# EAGLE design XO-Tester (EAGLE 6.2)
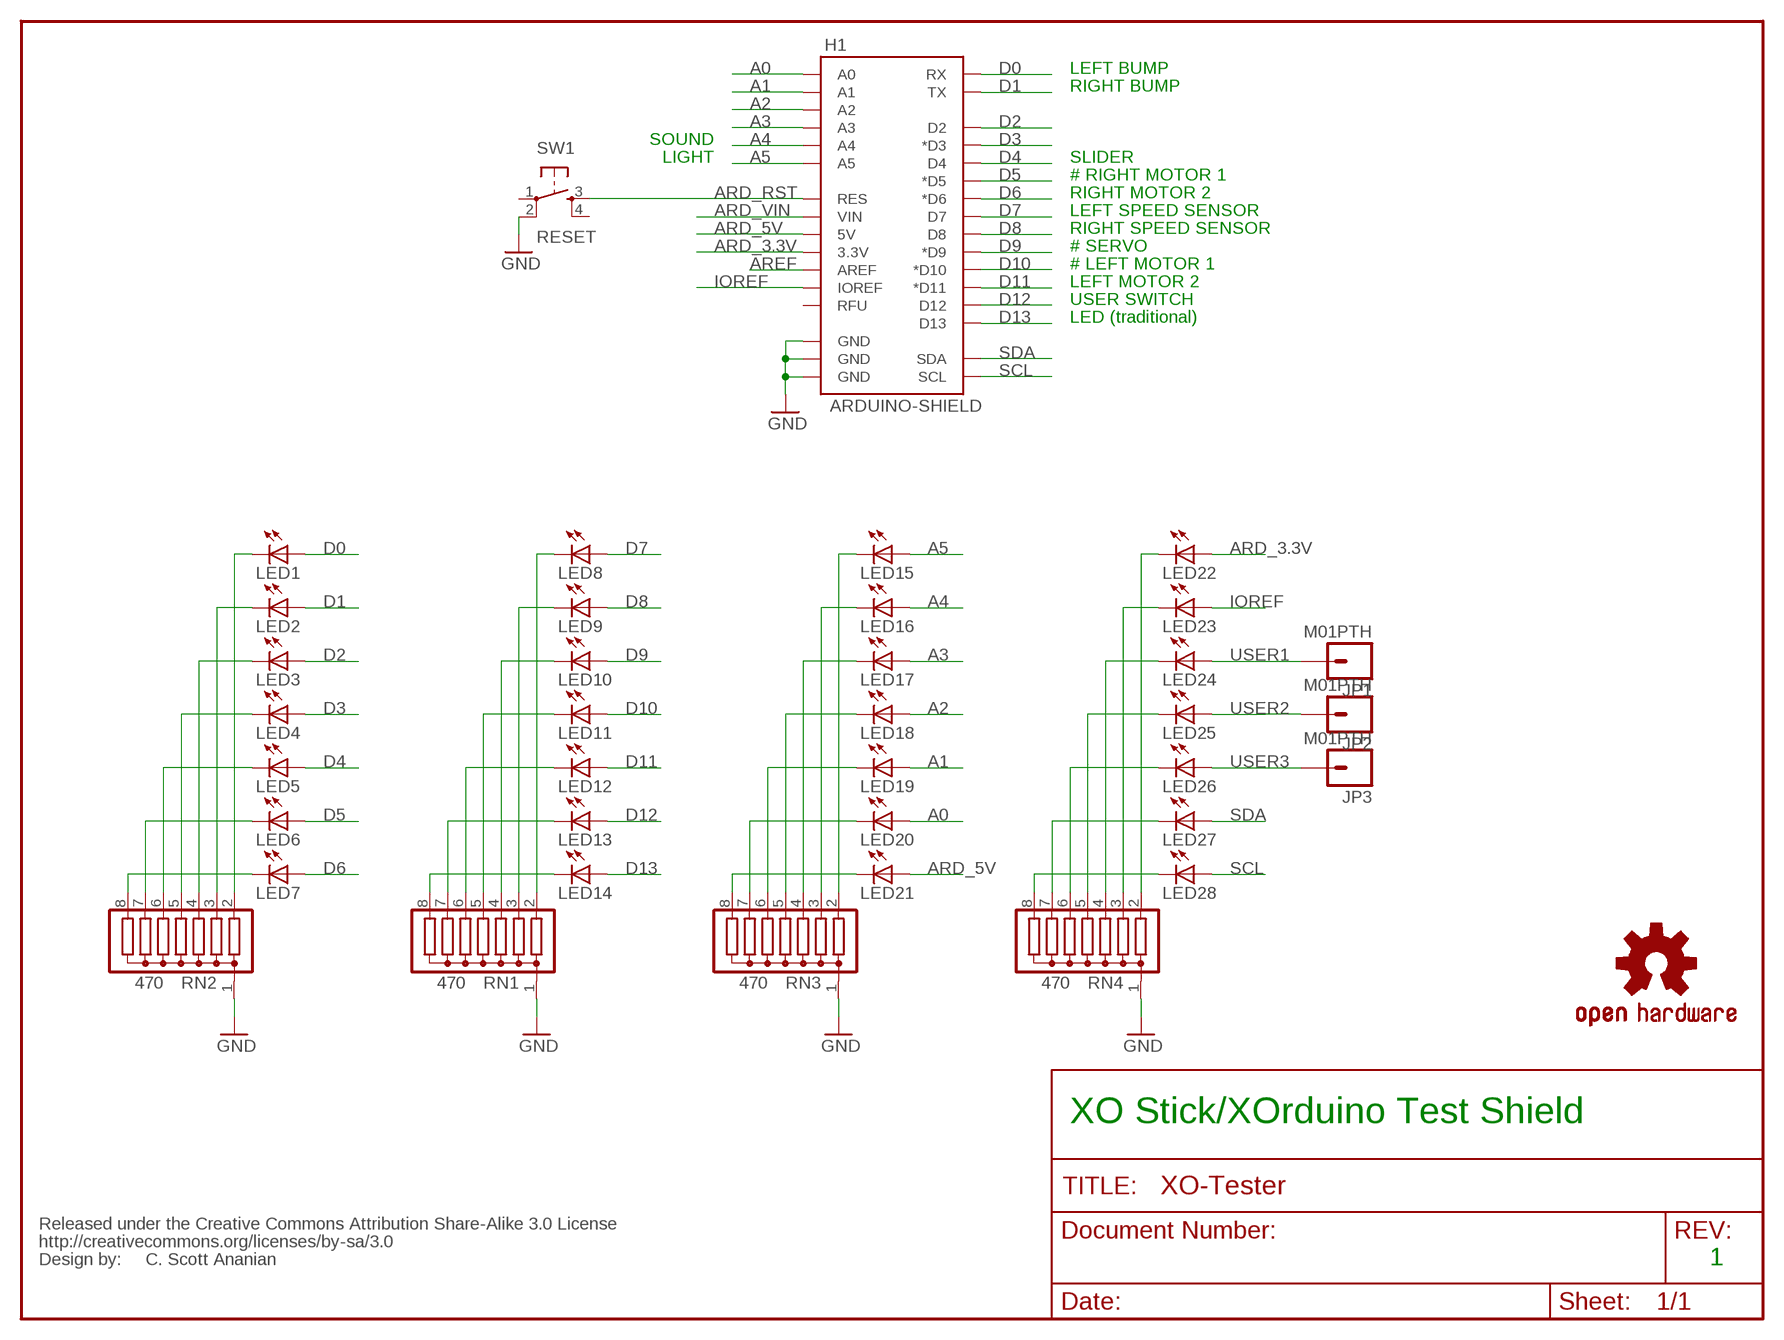
[diagram p0: schematic, sheet 1]

## Parts
H1  ARDUINO-SHIELD  [ARDUINO-SHIELD-VIAS-HOLES]
JP1  M01PTH  [1X01]
JP2  M01PTH  [1X01]
JP3  M01PTH  [1X01]
LED1  LED3MM-KIT  [LED3MM-KIT]
LED2  LED3MM-KIT  [LED3MM-KIT]
LED3  LED3MM-KIT  [LED3MM-KIT]
LED4  LED3MM-KIT  [LED3MM-KIT]
LED5  LED3MM-KIT  [LED3MM-KIT]
LED6  LED3MM-KIT  [LED3MM-KIT]
LED7  LED3MM-KIT  [LED3MM-KIT]
LED8  LED3MM-KIT  [LED3MM-KIT]
LED9  LED3MM-KIT  [LED3MM-KIT]
LED10  LED3MM-KIT  [LED3MM-KIT]
LED11  LED3MM-KIT  [LED3MM-KIT]
LED12  LED3MM-KIT  [LED3MM-KIT]
LED13  LED3MM-KIT  [LED3MM-KIT]
LED14  LED3MM-KIT  [LED3MM-KIT]
LED15  LED3MM-KIT  [LED3MM-KIT]
LED16  LED3MM-KIT  [LED3MM-KIT]
LED17  LED3MM-KIT  [LED3MM-KIT]
LED18  LED3MM-KIT  [LED3MM-KIT]
LED19  LED3MM-KIT  [LED3MM-KIT]
LED20  LED3MM-KIT  [LED3MM-KIT]
LED21  LED3MM-KIT  [LED3MM-KIT]
LED22  LED3MM-KIT  [LED3MM-KIT]
LED23  LED3MM-KIT  [LED3MM-KIT]
LED24  LED3MM-KIT  [LED3MM-KIT]
LED25  LED3MM-KIT  [LED3MM-KIT]
LED26  LED3MM-KIT  [LED3MM-KIT]
LED27  LED3MM-KIT  [LED3MM-KIT]
LED28  LED3MM-KIT  [LED3MM-KIT]
RN1  470  G07R  [SIL8]
RN2  470  G07R  [SIL8]
RN3  470  G07R  [SIL8]
RN4  470  G07R  [SIL8]
SW1  RESET  TAC_SWITCHPTH  [TACTILE-PTH]
U$1  OSHW-LOGOM  [OSHW-LOGO-M]
U$4  CREATIVE_COMMONS  [CREATIVE_COMMONS]

## Nets
A0: H1.A0 LED20.A
A1: H1.A1 LED19.A
A2: H1.A2 LED18.A
A3: H1.A3 LED17.A
A4: H1.A4 LED16.A
A5: H1.A5 LED15.A
ARD_3.3V [vcc]: H1.3.3V LED22.A
ARD_5V [vcc]: H1.5V LED21.A
ARD_RST: H1.RES SW1.3
ARD_VIN [vcc]: H1.VIN
AREF: H1.AREF
D0: H1.RX LED1.A
D1: H1.TX LED2.A
D2: H1.D2 LED3.A
D3: H1.D3(*D3) LED4.A
D4: H1.D4 LED5.A
D5: H1.D5(*D5) LED6.A
D6: H1.D6(*D6) LED7.A
D7: H1.D7 LED8.A
D8: H1.D8 LED9.A
D9: H1.D9(*D9) LED10.A
D10: H1.D10(*D10) LED11.A
D11: H1.D11(*D11) LED12.A
D12: H1.D12 LED13.A
D13: H1.D13 LED14.A
GND [gnd]: H1.GND@0(GND) H1.GND@1(GND) H1.GND@2(GND) RN1.1 RN2.1 RN3.1 RN4.1 SW1.2
IOREF: H1.IOREF LED23.A
N$1: LED8.K(C) RN1.2
N$2: LED9.K(C) RN1.3
N$3: LED1.K(C) RN2.2
N$4: LED2.K(C) RN2.3
N$5: LED3.K(C) RN2.4
N$6: LED4.K(C) RN2.5
N$7: LED5.K(C) RN2.6
N$8: LED6.K(C) RN2.7
N$9: LED7.K(C) RN2.8
N$10: LED10.K(C) RN1.4
N$11: LED11.K(C) RN1.5
N$12: LED12.K(C) RN1.6
N$13: LED13.K(C) RN1.7
N$14: LED14.K(C) RN1.8
N$15: LED15.K(C) RN3.2
N$16: LED16.K(C) RN3.3
N$17: LED17.K(C) RN3.4
N$18: LED18.K(C) RN3.5
N$19: LED19.K(C) RN3.6
N$20: LED20.K(C) RN3.7
N$21: LED21.K(C) RN3.8
N$22: LED22.K(C) RN4.2
N$23: LED23.K(C) RN4.3
N$24: LED24.K(C) RN4.4
N$25: LED25.K(C) RN4.5
N$26: LED26.K(C) RN4.6
N$27: LED27.K(C) RN4.7
N$28: LED28.K(C) RN4.8
SCL: H1.SCL LED28.A
SDA: H1.SDA LED27.A
USER1: JP1.1 LED24.A
USER2: JP2.1 LED25.A
USER3: JP3.1 LED26.A
Unconnected: H1.RFU SW1.1 SW1.4

## Notes on the sheet
- LEFT BUMP
- RIGHT BUMP
- SOUND
- LIGHT | SLIDER
- # RIGHT MOTOR 1
- RIGHT MOTOR 2
- LEFT SPEED SENSOR
- RIGHT SPEED SENSOR
- # SERVO
- # LEFT MOTOR 1
- LEFT MOTOR 2
- USER SWITCH
- LED (traditional)
- XO Stick/XOrduino Test Shield
- C. Scott Ananian | 1

## Library data of the parts
H1 = xorduino:ARDUINO-SHIELD: Arduino 1.0 Shield Footprint.
JP1-JP3 = SparkFun-Connectors:M01: Header 1 Standard 1-pin 0.1" header. Use with straight break away headers (SKU : PRT-00116), right angle break away headers (PRT-00553), swiss pins (PRT-00743), machine pins (PRT-00117), and female headers (PRT-00115).
LED1-LED28 = xorduino:LED
RN1-RN4 = resistor-sil:G07R: SIL RESISTOR; OC_FARNELL: unknown; OC_NEWARK: unknown
SW1 = SparkFun:TAC_SWITCH: Momentary Switch Button commonly used for reset or general input. Spark Fun Electronics SKU : COM-00097
U$1 = SparkFun:OSHW-LOGO: Open Source Hardware Logo This logo indicates the piece of hardware it is found on incorporates a OSHW license and/or adheres to the definition of open source hardware found here: http://freedomdefined.org/OSHW
U$4 = SparkFun:CREATIVE_COMMONS

## Net classes
0 default: width 0.254 mm, drill 0.508 mm, clearance 0.254 mm
1 vcc: width 0.508 mm, drill 0.508 mm, clearance 0.254 mm
2 gnd: width 0.508 mm, drill 0.508 mm, clearance 0.254 mm

## Board
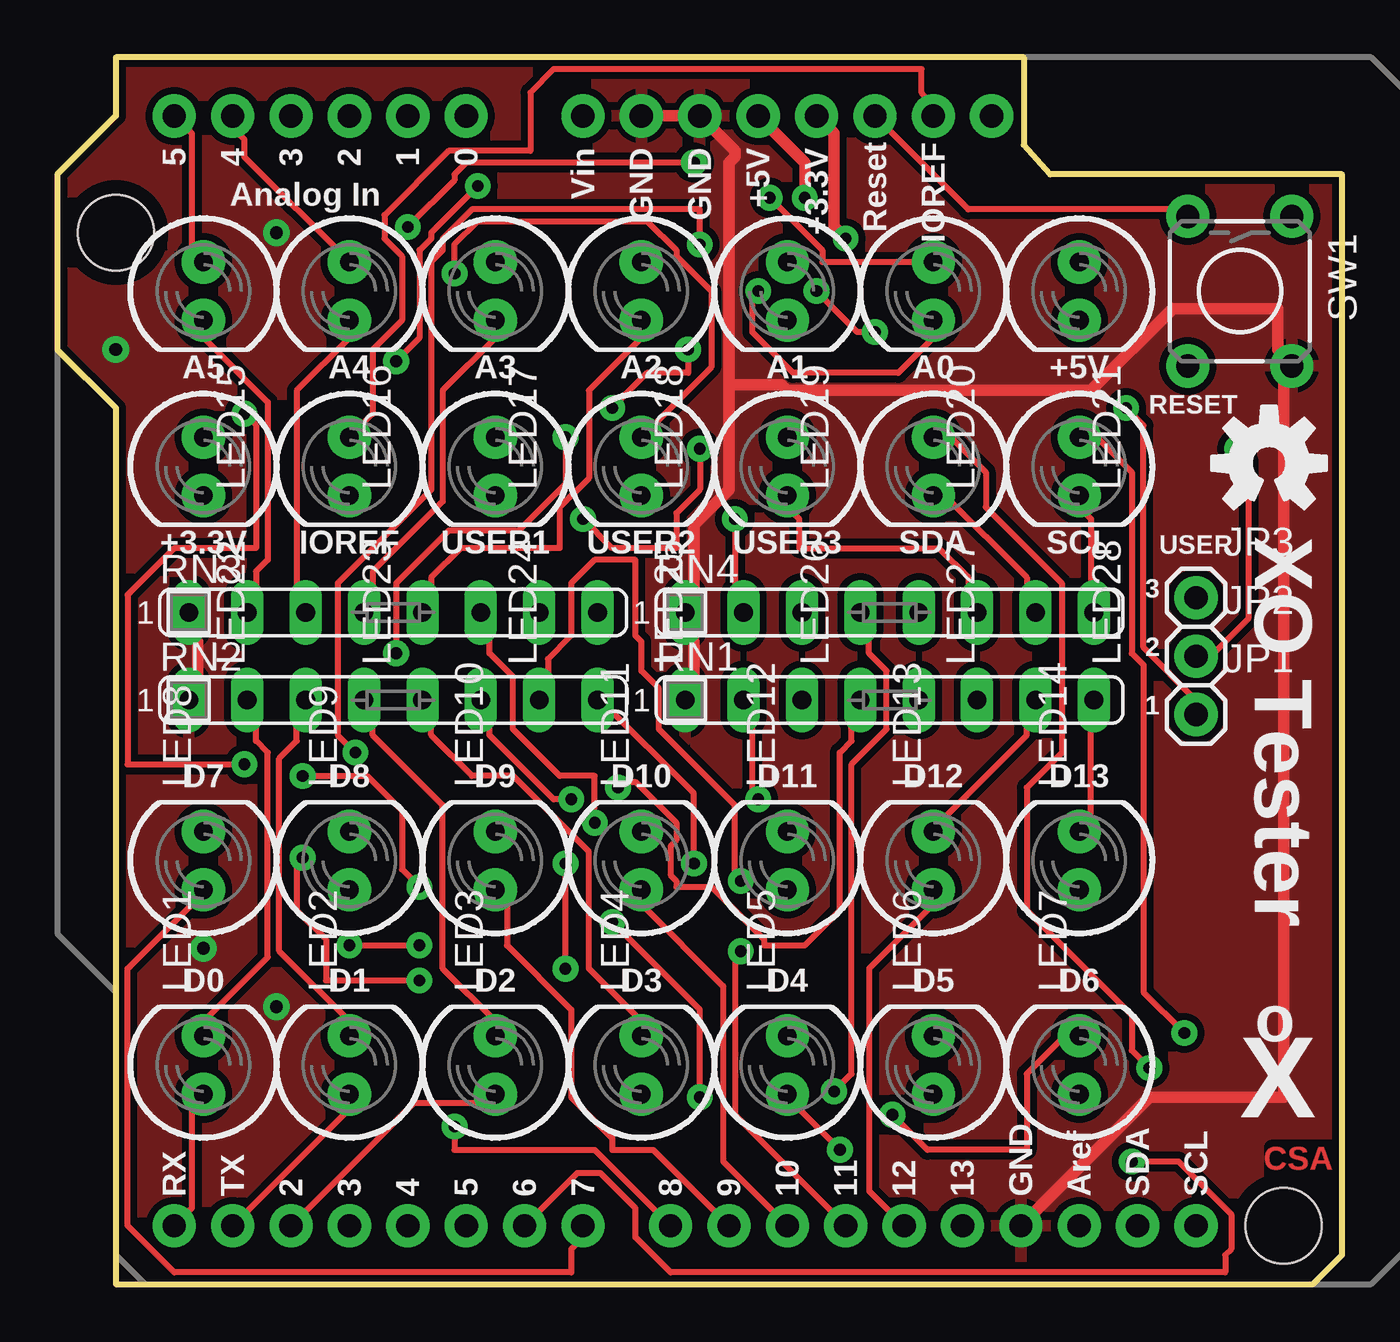
[diagram p1: board, top side]
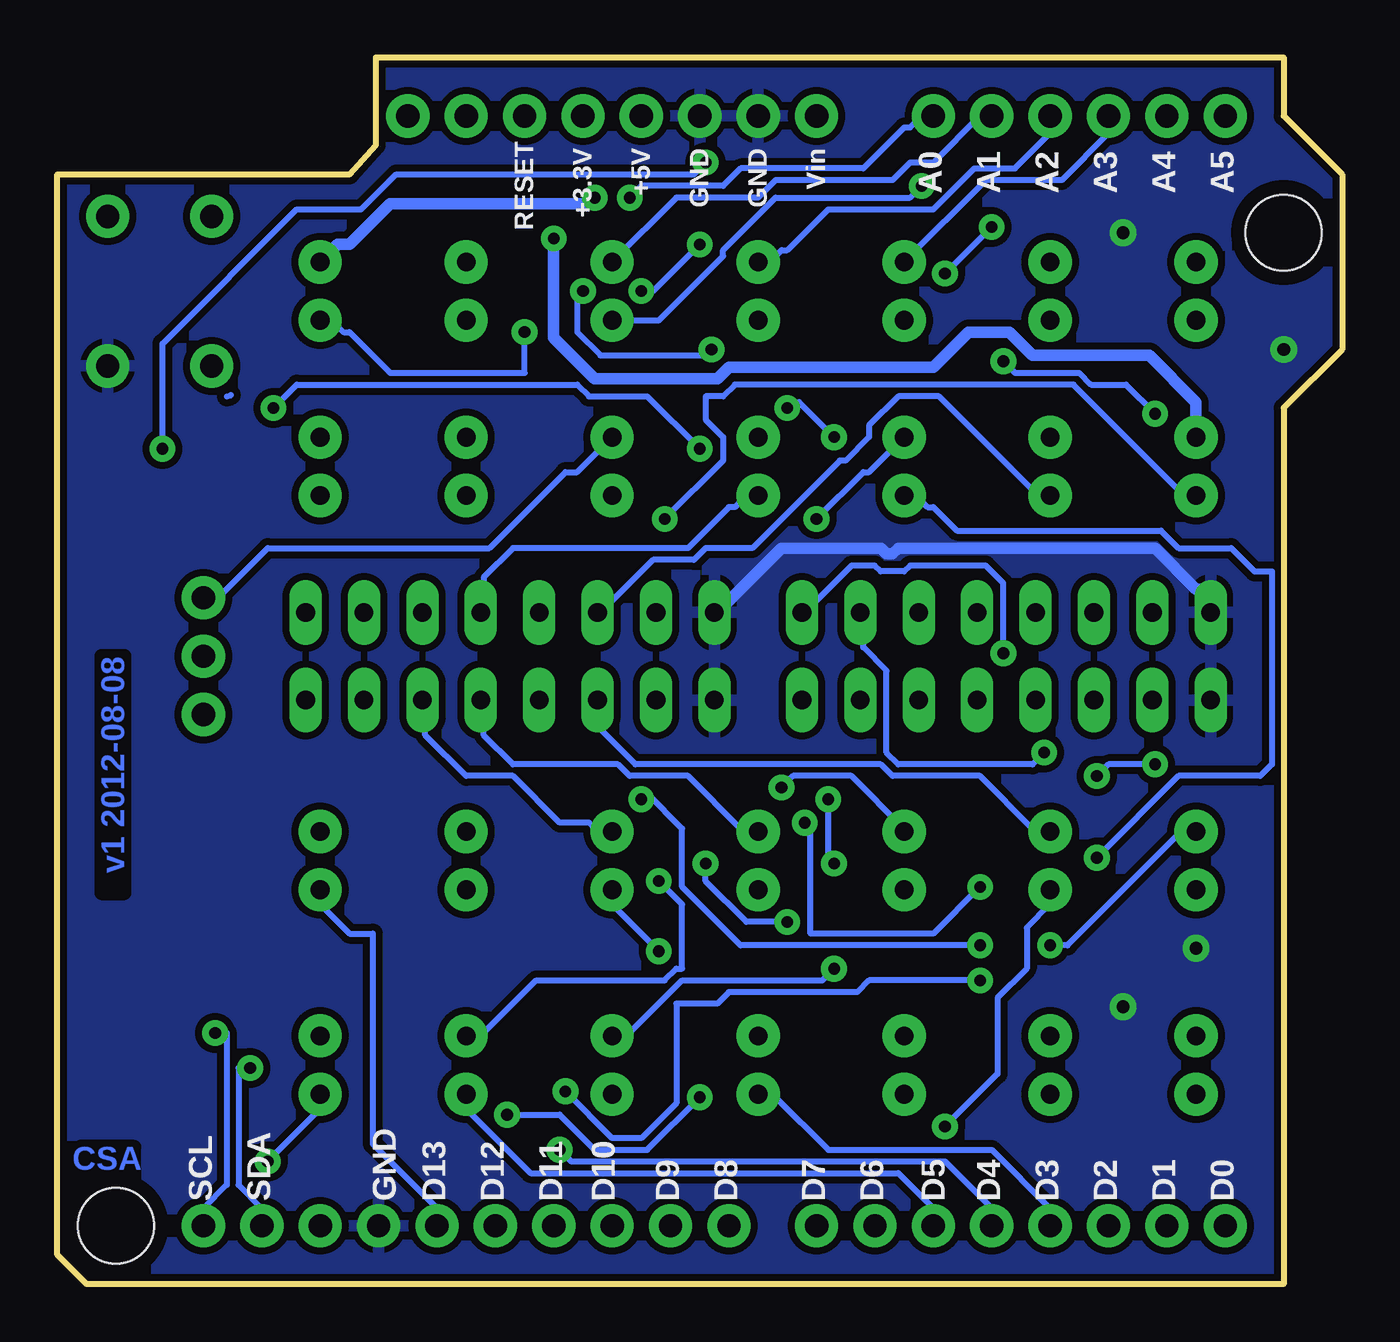
[diagram p2: board, bottom side, seen from below]

Size 55.88 x 53.34 mm. Coordinates in mm from the lower left corner, seen from the top.
Outline: 55.88,48.26 43.18,48.26 42.04,49.53 42.04,53.34 2.54,53.34 2.54,50.8 0,48.26 0,40.64 2.54,38.1 2.54,0 54.61,0 55.88,1.27 55.88,48.26
Copper layers (1+16): Top 0.035mm / dielectric 0.2mm / Bottom 0.035mm
Design rules: minimum track width 8mil, minimum drill 20mil, track to track 8mil, track to pad 8mil, pad to pad 8mil, via to via 8mil, smd to smd 8mil, copper to edge 10mil, drill to drill 8mil, minimum pad ring 12mil, minimum via ring 12mil, stop-mask expansion 4mil, vias tented up to drill 25mil, thermal gap 10mil
vRestrict: area 51.9,28.3 to 54.7,32.5; area 51.9,13 to 54.7,25.5

### Footprints (pad centres in the part's own frame; a part is rotated, then mirrored left to right if it is on the bottom)
ARDUINO-SHIELD-VIAS-HOLES = drill 1.016 pad 1.88: 3.3V 30.48,50.8; 5V 27.94,50.8; A0 15.24,50.8; A1 12.7,50.8; A2 10.16,50.8; A3 7.62,50.8; A4 5.08,50.8; A5 2.54,50.8; AREF 41.91,2.54; D2 7.62,2.54; D3 10.16,2.54; D4 12.7,2.54; D5 15.24,2.54; D6 17.78,2.54; D7 20.32,2.54; D8 24.13,2.54; D9 26.67,2.54; D10 29.21,2.54; D11 31.75,2.54; D12 34.29,2.54; D13 36.83,2.54; GND@0 25.4,50.8; GND@1 22.86,50.8; GND@2 39.37,2.54; IOREF 35.56,50.8; RES 33.02,50.8; RFU 38.1,50.8; RX 2.54,2.54; SCL 46.99,2.54; SDA 44.45,2.54; TX 5.08,2.54; VIN 20.32,50.8 | hole 3.302: 0,45.72; 50.8,2.54
1X01 = drill 1.016 pad 1.88: 1 0,0
LED3MM-KIT = drill 0.813 pad 1.88: A -1.27,0; K 1.27,0
SIL8 = drill 0.813 long: 1 -8.89,0; 2 -6.35,0; 3 -3.81,0; 4 -1.27,0; 5 1.27,0; 6 3.81,0; 7 6.35,0; 8 8.89,0
TACTILE-PTH = drill 1.016 pad 1.88: 1 -3.251,2.261; 2 3.251,2.261; 3 -3.251,-2.261; 4 3.251,-2.261

### Placement (x,y rotation side)
H1  2.54,0 0 top
JP1  49.53,24.77 0 top
JP2  49.53,27.3 0 top
JP3  49.53,29.84 0 top
LED1  6.35,9.53 90 top
LED2  12.7,9.53 90 top
LED3  19.05,9.53 90 top
LED4  25.4,9.53 90 top
LED5  31.75,9.53 90 top
LED6  38.1,9.53 90 top
LED7  44.45,9.53 90 top
LED8  6.35,18.41 90 top
LED9  12.7,18.41 90 top
LED10  19.05,18.41 90 top
LED11  25.4,18.41 90 top
LED12  31.75,18.41 90 top
LED13  38.1,18.41 90 top
LED14  44.45,18.41 90 top
LED15  6.35,43.18 270 top
LED16  12.7,43.18 270 top
LED17  19.05,43.18 270 top
LED18  25.4,43.18 270 top
LED19  31.75,43.18 270 top
LED20  38.1,43.18 270 top
LED21  44.45,43.18 270 top
LED22  6.35,35.56 270 top
LED23  12.7,35.56 270 top
LED24  19.05,35.56 270 top
LED25  25.4,35.56 270 top
LED26  31.75,35.56 270 top
LED27  38.1,35.56 270 top
LED28  44.45,35.56 270 top
RN1  36.2,25.4 0 top
RN2  14.61,25.4 0 top
RN3  14.61,29.21 0 top
RN4  36.2,29.21 0 top
SW1  51.44,43.18 270 top
U$1  52.7,35.69 0 top
U$4  20.32,-10.16 0 top  (outside the outline)

### Tracks (layer width: path | path; a pad name or v marks a point on that pad's centre or on a via)
A0  (via drill 0.51)
  Top 0.254: LED20.A 33.27,44.45 33.27,44.96 v30.99,47.24
  Bottom 0.254: v30.99,47.24 30.48,47.75 26.92,47.75 26.16,48.51 20.83,48.51 19.05,50.29 18.8,50.29 18.29,50.8 H1.A0
A1
  Bottom 0.254: LED19.A 28.96,47.24 25.4,47.24 24.64,48.01 19.56,48.01 18.8,48.77 17.78,48.77 15.75,50.8 H1.A1
A2
  Bottom 0.254: H1.A2 12.7,50.04 14.22,48.51 16,48.51 17.78,46.74 22.35,46.74 24.13,44.96 24.38,44.96 24.89,44.45 LED18.A
A3
  Bottom 0.254: LED17.A 15.49,48.01 12.19,48.01 10.16,50.04 H1.A3
A4
  Top 0.254: LED16.A 8.13,49.02 8.13,49.78 7.62,50.29 H1.A4
A5
  Top 0.254: LED15.A 5.84,44.96 5.84,50.04 H1.A5
ARD_3.3V  (via drill 0.51)
  Top 0.508: v34.29,45.47 33.78,45.97 33.78,50.04 H1.3.3V
  Bottom 0.508: LED22.A 6.35,38.35 8.38,40.39 13.46,40.39 14.48,41.4 16.26,41.4 17.78,39.88 26.67,39.88 27.18,39.37 32.51,39.37 34.29,41.15 v34.29,45.47
ARD_5V  (via drill 0.51)
  Top 0.508: H1.5V 32.51,48.77 v32.51,47.24
  Bottom 0.508: v32.51,47.24 32.77,46.99 41.4,46.99 43.18,45.21 43.69,45.21 LED21.A
ARD_RST
  Top 0.254: H1.RES 39.62,46.74 49.02,46.74 49.02,46.48 SW1.3
D0
  Top 0.254: H1.RX 5.84,3.3 5.84,7.62 6.35,8.13 LED1.A
D1
  Top 0.254: H1.TX 12.7,7.62 12.7,8.13 LED2.A
D2
  Top 0.254: H1.D2 15.49,7.87 19.05,7.87 19.05,8.13 LED3.A
D3
  Bottom 0.254: H1.D3 12.7,3.3 15.24,5.84 22.35,5.84 24.64,8.13 25.4,8.13 LED4.A
D4  (via drill 0.51)
  Top 0.254: v34.04,5.84 31.75,8.13 LED5.A
  Bottom 0.254: H1.D4 15.24,3.3 17.27,5.33 33.53,5.33 v34.04,5.84
D5
  Bottom 0.254: H1.D5 17.78,3.3 19.3,4.83 35.31,4.83 38.1,7.62 38.1,8.13 LED6.A
D6  (via drill 0.51)
  Top 0.254: H1.D6 22.61,4.83 23.62,4.83 25.15,3.3 25.15,2.03 26.67,0.51 50.8,0.51 50.8,1.27 51.05,1.52 51.05,3.05 48.77,5.33 v46.74,5.33
  Bottom 0.254: v46.74,5.33 44.45,7.62 44.45,8.13 LED7.A
D7
  Top 0.254: H1.D7 22.86,2.03 22.35,1.52 22.35,0.51 5.08,0.51 3.05,2.54 3.05,13.72 6.35,17.02 LED8.A
D8  (via drill 0.51)
  Top 0.254: H1.D8 23.37,5.84 17.27,5.84 v17.27,6.86
  Bottom 0.254: v17.27,6.86 14.99,9.14 14.99,12.45 13.72,13.72 13.72,15.49 12.7,16.51 12.7,17.02 LED9.A
D9
  Top 0.254: H1.D9 25.91,5.84 24.13,5.84 24.13,6.35 22.35,8.13 22.35,11.94 19.56,14.73 19.56,16.51 19.05,17.02 LED10.A
D10
  Top 0.254: H1.D10 28.96,5.33 28.96,12.95 25.4,16.51 25.4,17.02 LED11.A
D11  (via drill 0.51)
  Top 0.254: H1.D11 29.46,7.37 29.46,14.22 v29.72,14.48
  Bottom 0.254: v29.72,14.48 31.75,16.51 31.75,17.02 LED12.A
D12
  Top 0.254: H1.D12 35.31,4.06 35.31,13.72 38.1,16.51 38.1,17.02 LED13.A
D13
  Bottom 0.254: H1.D13 39.37,3.3 42.16,6.1 42.16,15.24 43.18,15.24 44.45,16.51 44.45,17.02 LED14.A
GND  (via drill 0.56 pad 1.07)
  Top 0.508: H1.GND@1 H1.GND@0 29.46,49.28 29.46,49.02 29.21,48.77 29.21,39.12 | RN2.1 5.84,25.4 6.1,25.65 6.1,27.94 5.84,28.19 5.84,29.21 RN3.1 | RN1.1 27.43,25.4 27.69,25.65 27.69,27.94 27.43,28.19 27.43,29.21 RN4.1 27.69,28.19 27.69,33.02 29.21,34.54 29.21,39.12 | H1.GND@2 47.5,8.13 53.34,8.13 53.34,39.62 53.59,39.88 SW1.2 53.59,40.13 53.09,40.64 53.09,42.42 48.51,42.42 44.96,38.86 31.75,38.86 31.5,39.12 29.21,39.12
  Bottom 0.508: RN3.1 5.84,29.21 5.84,30.23 6.35,30.23 8.13,32 19.3,32 19.56,31.75 19.81,31.75 20.07,32 24.38,32 27.18,29.21 RN4.1
  other vias: 9.53,12.06 2.54,40.64 9.53,45.72 6.35,14.61
  pour Bottom (isolate 0.305): 2.54,0 2.54,38.1 0,40.64 0,48.26 2.54,50.8 2.54,53.34 41.91,53.34 41.91,49.53 43.18,48.26 55.88,48.26 55.88,0
  pour Top (isolate 0.305): 2.54,0 2.54,38.1 0,40.64 0,48.26 2.54,50.8 2.54,53.34 41.91,53.34 41.91,49.53 43.18,48.26 55.88,48.26 55.88,0
IOREF
  Top 0.254: LED23.A 13.72,37.85 13.72,40.64 14.99,41.91 14.99,44.7 14.22,45.47 14.22,46.48 17.02,49.28 20.57,49.28 20.57,51.82 21.59,52.83 37.59,52.83 37.59,51.82 38.1,51.31 H1.IOREF
N$1  (via drill 0.51)
  Top 0.254: v30.48,21.08 30.23,21.34 30.23,25.15 29.97,25.4 RN1.2 | v12.7,14.73 v15.75,14.73
  Bottom 0.254: v30.48,21.08 30.23,21.34 28.7,19.81 28.7,17.27 26.16,14.73 v15.75,14.73 | v12.7,14.73 11.94,14.73 7.11,19.56 6.35,19.56 LED8.K
N$2
  Bottom 0.254: RN1.3 32.26,25.4 32.26,24.13 30.73,22.61 20.07,22.61 19.56,22.1 15.75,22.1 13.46,19.81 12.7,19.81 LED9.K
N$3
  Top 0.254: RN2.2 8.38,25.4 8.64,25.15 8.64,23.62 9.14,23.11 9.14,14.22 6.35,11.43 6.35,10.92 LED1.K
N$4
  Top 0.254: RN2.3 10.67,25.4 10.41,25.15 10.41,23.62 9.65,22.86 9.65,14.48 12.7,11.43 12.7,10.92 LED2.K
N$5
  Top 0.254: RN2.4 13.46,25.4 13.72,25.15 13.72,23.88 16.76,20.83 16.76,13.72 19.05,11.43 19.05,10.92 LED3.K
N$6
  Top 0.254: RN2.5 16,25.4 16.26,25.15 16.26,23.88 18.03,22.1 19.81,22.1 23.11,18.8 23.11,13.72 25.4,11.43 25.4,10.92 LED4.K
N$7  (via drill 0.51)
  Top 0.254: v22.35,21.08 21.59,21.08 18.8,23.88 18.8,25.15 18.54,25.4 RN2.6 | v22.1,13.72 v22.1,18.29
  Bottom 0.254: v22.35,21.08 22.35,18.29 v22.1,18.29 | v22.1,13.72 22.61,13.21 28.7,13.21 30.99,10.92 31.75,10.92 LED5.K
N$8  (via drill 0.51)
  Top 0.254: v29.72,17.53 29.46,17.78 29.46,20.83 26.16,24.13 26.16,25.91 25.4,26.67 25.4,27.94 25.15,28.19 25.15,31.5 23.37,31.5 22.35,30.48 22.35,28.19 21.34,27.18 21.34,25.65 21.08,25.4 RN2.7
  Bottom 0.254: v29.72,17.53 28.7,16.51 28.7,13.72 28.96,13.72 29.46,13.21 35.05,13.21 37.34,10.92 38.1,10.92 LED6.K
N$9  (via drill 0.51)
  Top 0.254: v27.69,18.29 27.69,21.34 23.62,25.4 RN2.8 | v24.13,15.75 27.94,11.94 v27.94,8.13 | v36.32,7.37 37.85,5.84 42.16,5.84 42.16,9.14 43.69,10.67 44.45,10.67 LED7.K
  Bottom 0.254: v27.69,18.29 27.69,17.53 25.91,15.75 v24.13,15.75 | v27.94,8.13 30.23,5.84 32.51,5.84 34.04,7.37 v36.32,7.37
N$10  (via drill 0.51)
  Top 0.254: v24.38,21.59 24.38,21.84 25.15,21.84 26.92,20.07 26.92,19.3 26.67,19.05 26.67,17.78 26.92,17.53 26.92,17.27 28.45,17.27 30.73,14.99 30.73,14.73 32.51,14.73 34.04,16.26 34.04,23.11 34.54,23.62 34.54,25.15 34.8,25.4 RN1.4
  Bottom 0.254: v24.38,21.59 23.88,22.1 21.34,22.1 19.05,19.81 LED10.K
N$11
  Bottom 0.254: RN1.5 37.34,25.4 37.34,23.88 36.07,22.61 31.5,22.61 30.99,22.1 28.45,22.1 26.16,19.81 25.4,19.81 LED11.K
N$12
  Bottom 0.254: RN1.6 39.88,25.4 39.88,23.88 38.1,22.1 36.07,22.1 34.04,20.07 32.77,20.07 32.51,19.81 31.75,19.81 LED12.K
N$13
  Top 0.254: RN1.7 42.42,25.4 42.16,25.15 42.16,23.88 38.1,19.81 LED13.K
N$14
  Top 0.254: RN1.8 44.96,25.4 44.96,20.32 44.45,19.81 LED14.K
N$15
  Top 0.254: LED15.K 6.35,41.15 9.14,38.35 9.14,31.5 8.64,30.99 8.64,29.46 8.38,29.21 RN3.2
N$16
  Top 0.254: LED16.K 12.7,41.15 10.41,38.86 10.41,29.46 10.67,29.21 RN3.3
N$17
  Top 0.254: LED17.K 19.05,41.15 16.76,38.86 16.76,34.04 13.72,30.99 13.72,29.46 13.46,29.21 RN3.4
N$18
  Top 0.254: LED18.K 25.4,41.15 23.11,38.86 23.11,35.05 21.84,33.78 21.84,32 17.53,32 16.26,30.73 16.26,29.46 16,29.21 RN3.5
N$19  (via drill 0.51)
  Top 0.254: v23.37,20.07 23.37,22.1 21.84,22.1 19.81,24.13 19.81,26.42 18.8,27.43 18.8,28.96 18.54,29.21 RN3.6 | v15.75,17.27 14.99,18.03 14.99,20.57 13.46,22.1 v10.67,22.1 | v8.13,22.61 3.05,22.61 3.05,29.97 5.08,32 8.64,32 8.64,37.34 v8.13,37.85 | v14.73,40.13 15.75,41.15 15.75,44.96 16.26,45.47 16.26,45.72 v18.29,47.75
  Bottom 0.254: v23.37,20.07 23.11,19.81 23.11,15.24 17.78,15.24 v15.75,17.27 | v10.67,22.1 10.16,22.61 v8.13,22.61 | v8.13,37.85 9.4,39.12 10.92,39.12 11.43,39.62 14.22,39.62 v14.73,40.13 | v18.29,47.75 18.8,47.24 24.64,47.24 26.92,44.96 26.92,44.7 29.72,41.91 LED19.K
N$20  (via drill 0.51)
  Top 0.254: v12.95,23.11 12.19,23.88 12.19,30.48 16.26,34.54 16.26,44.45 16.76,44.96 16.76,45.47 18.03,46.74 27.94,46.74 v27.94,45.21 | v30.48,43.18 30.23,42.93 30.23,41.4 32,39.62 36.58,39.62 38.1,41.15 LED20.K
  Bottom 0.254: v12.95,23.11 13.46,22.61 19.3,22.61 19.81,23.11 19.81,26.67 20.83,27.69 20.83,29.21 RN3.7 | v27.94,45.21 29.97,43.18 v30.48,43.18
N$21  (via drill 0.51)
  Top 0.254: v14.73,27.43 14.73,30.48 17.02,32.77 20.07,32.77 22.1,34.8 v22.1,36.83 | v24.13,38.1 25.65,39.62 27.43,39.62 v27.43,40.64 | v33.02,43.18 34.8,41.4 v35.56,41.4
  Bottom 0.254: v14.73,27.43 14.73,30.48 15.49,31.24 18.8,31.24 19.05,30.99 20.07,30.99 20.32,31.24 21.34,31.24 23.37,29.21 RN3.8 | v22.1,36.83 23.62,38.35 23.88,38.35 v24.13,38.1 | v27.43,40.64 27.69,40.39 32.26,40.39 33.27,41.4 33.27,42.93 v33.02,43.18 | v35.56,41.4 35.56,39.62 41.4,39.62 43.18,41.4 43.43,41.4 43.94,41.91 LED21.K
N$22  (via drill 0.51)
  Top 0.254: v29.46,33.27 29.46,29.46 29.72,29.21 RN4.2
  Bottom 0.254: v29.46,33.27 26.92,35.81 26.92,36.83 27.69,37.59 27.69,38.61 26.92,38.61 26.42,39.12 11.68,39.12 6.86,34.29 LED22.K
N$23
  Bottom 0.254: LED23.K 13.21,34.29 17.53,38.61 19.3,38.61 20.57,37.34 20.57,36.83 21.59,35.81 21.84,35.81 25.65,32 27.69,32 28.19,31.5 29.97,31.5 32.26,29.21 RN4.3
N$24  (via drill 0.51)
  Top 0.254: v33.78,8.38 34.54,9.14 34.54,22.61 36.07,24.13 36.07,26.67 35.31,27.43 35.31,28.96 35.05,29.21 RN4.4 | v15.75,13.21 11.68,13.21 11.68,14.99 10.41,16.26 10.41,18.29 v10.67,18.54
  Bottom 0.254: v33.78,8.38 31.75,6.35 30.48,6.35 28.96,7.87 28.96,12.19 27.18,12.19 26.67,12.7 21.08,12.7 20.57,13.21 v15.75,13.21 | v10.67,18.54 7.11,22.1 3.56,22.1 3.05,22.61 3.05,30.99 3.81,30.99 4.83,32 7.11,32 7.87,32.77 16.76,32.77 17.78,33.78 18.03,33.78 18.54,34.29 LED24.K
N$25
  Bottom 0.254: LED25.K 25.91,34.29 26.42,33.78 26.67,33.78 28.45,32 36.07,32 37.34,30.73 37.34,29.21 RN4.5
N$26
  Top 0.254: LED26.K 31.75,33.78 32.26,33.27 32.26,32 38.35,32 39.62,30.73 39.62,29.46 39.88,29.21 RN4.6
N$27
  Top 0.254: LED27.K 38.61,34.29 42.16,30.73 42.16,29.46 42.42,29.21 RN4.7
N$28
  Top 0.254: LED28.K 44.45,33.78 44.96,33.27 44.96,29.21 RN4.8
SCL  (via drill 0.51)
  Top 0.254: v49.02,10.92 47.24,12.7 47.24,26.92 46.74,27.43 46.74,35.31 45.21,36.83 LED28.A
  Bottom 0.254: H1.SCL 49.53,3.3 48.51,4.32 48.51,10.92 v49.02,10.92
SDA  (via drill 0.51)
  Top 0.254: v47.5,9.4 46.74,10.16 46.74,11.68 42.16,16.26 42.16,21.59 43.69,23.11 43.69,30.48 40.39,33.78 40.39,35.31 38.86,36.83 LED27.A
  Bottom 0.254: H1.SDA 46.99,3.3 48.01,4.32 48.01,9.4 v47.5,9.4
USER1  (via drill 0.51)
  Top 0.254: v22.86,33.27 24.13,32 26.92,32 26.92,33.53 27.94,34.54 v27.94,36.32 | v46.48,38.1 47.24,37.34 47.24,27.69 49.53,25.4 49.53,24.89 JP1.1
  Bottom 0.254: LED24.A 20.57,35.31 20.83,35.31 v22.86,33.27 | v27.94,36.32 30.23,38.61 32.77,38.61 33.27,39.12 45.47,39.12 v46.48,38.1
USER2  (via drill 0.51)
  Top 0.254: LED25.A 28.45,39.88 28.45,43.18 26.92,44.7 26.92,44.96 25.65,46.23 18.29,46.23 17.27,45.21 v17.27,43.94 | v15.24,45.97 17.27,48.01 17.27,48.26 17.78,48.77 v27.69,48.77 | v51.31,36.32 51.82,35.81 51.82,28.96 50.29,27.43 49.53,27.43 JP2.1
  Bottom 0.254: v15.24,45.97 v17.27,43.94 | v27.69,48.77 28.19,48.26 41.15,48.26 42.67,46.74 45.47,46.74 51.31,40.89 v51.31,36.32
USER3
  Bottom 0.254: LED26.A 33.27,35.31 33.78,35.31 37.08,32 46.74,32 48.77,29.97 49.53,29.97 JP3.1
XYZ
  Bottom 0.254: 48.51,38.61 48.33,38.66 48.51,38.61

### Text on the board
Top: CSA
Bottom: v1 2012-08-08 | CSA
tPlace: A5 | A4 | A3 | A2 | A1 | A0 | +5V | RESET | XO Tester | +3.3V | IOREF | USER1 | USER2 | USER3 | SDA | SCL | USER | 3 | 2 | 1 | D7 | D8 | D9 | D10 | D11 | D12 | D13 | D0 | D1 | D2 | D3 | D4 | D5 | D6 | o | X
bPlace: RESET | A5 | A4 | A3 | A2 | A1 | A0 | Vin | GND | GND | +5V | +3.3V | D0 | D1 | D2 | D3 | D4 | D5 | D6 | D7 | D8 | D9 | D10 | D11 | D12 | D13 | GND | SDA | SCL
tValues: C. Scott Ananian